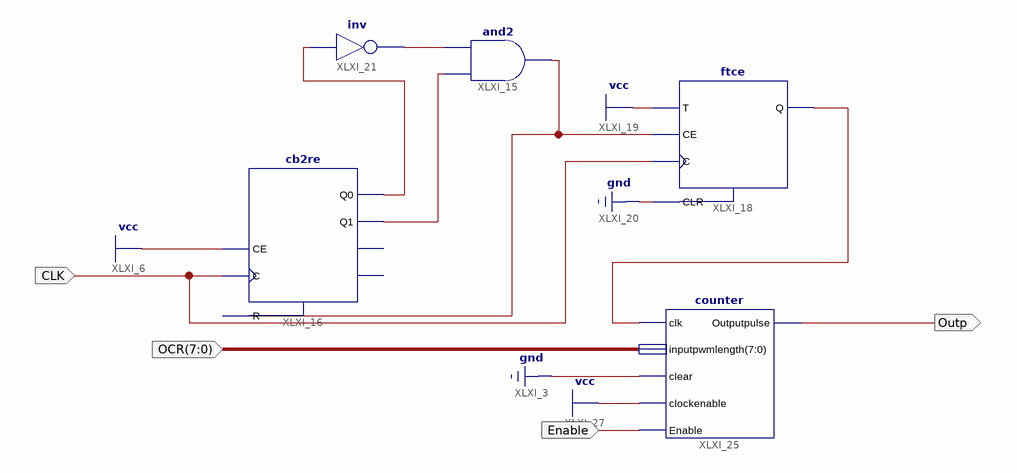
[diagram p0: schematic sheet 1]
// Xilinx ISE schematic Timer_PWM.sch (spartan3e) as structural Verilog: 5 symbols, 4 ports
module Timer_PWM (
  input  [7:0] OCR,
  input  CLK,
  input  Enable,
  output Outp
);

  wire XLXN_19, XLXN_21, XLXN_24, XLXN_25, XLXN_27;

  and XLXI_15 (XLXN_21, XLXN_19, XLXN_25);
  cb2re XLXI_16 (.C(CLK), .CE(1'b1), .R(XLXN_21), .Q0(XLXN_24), .Q1(XLXN_19));  // open: CEO, TC
  ftce XLXI_18 (.C(CLK), .CE(XLXN_21), .CLR(1'b0), .T(1'b1), .Q(XLXN_27));
  not XLXI_21 (XLXN_25, XLXN_24);
  counter XLXI_25 (
    .clk(XLXN_27), .clear(1'b0), .inputpwmlength(OCR), .clockenable(1'b1), .Outputpulse(Outp), .Enable(Enable));
endmodule
